# Altium schematic sheet Stepper_driver_group.SchDoc: STM32F446 CNC
size C; Author: AM; CompanyName: Expatria Technologies; DrawnBy: A.Marles; Engineer: AM; Organization: Expatria Technologies; DocumentNumber: 4; SheetNumber: 4; SheetTotal: 14
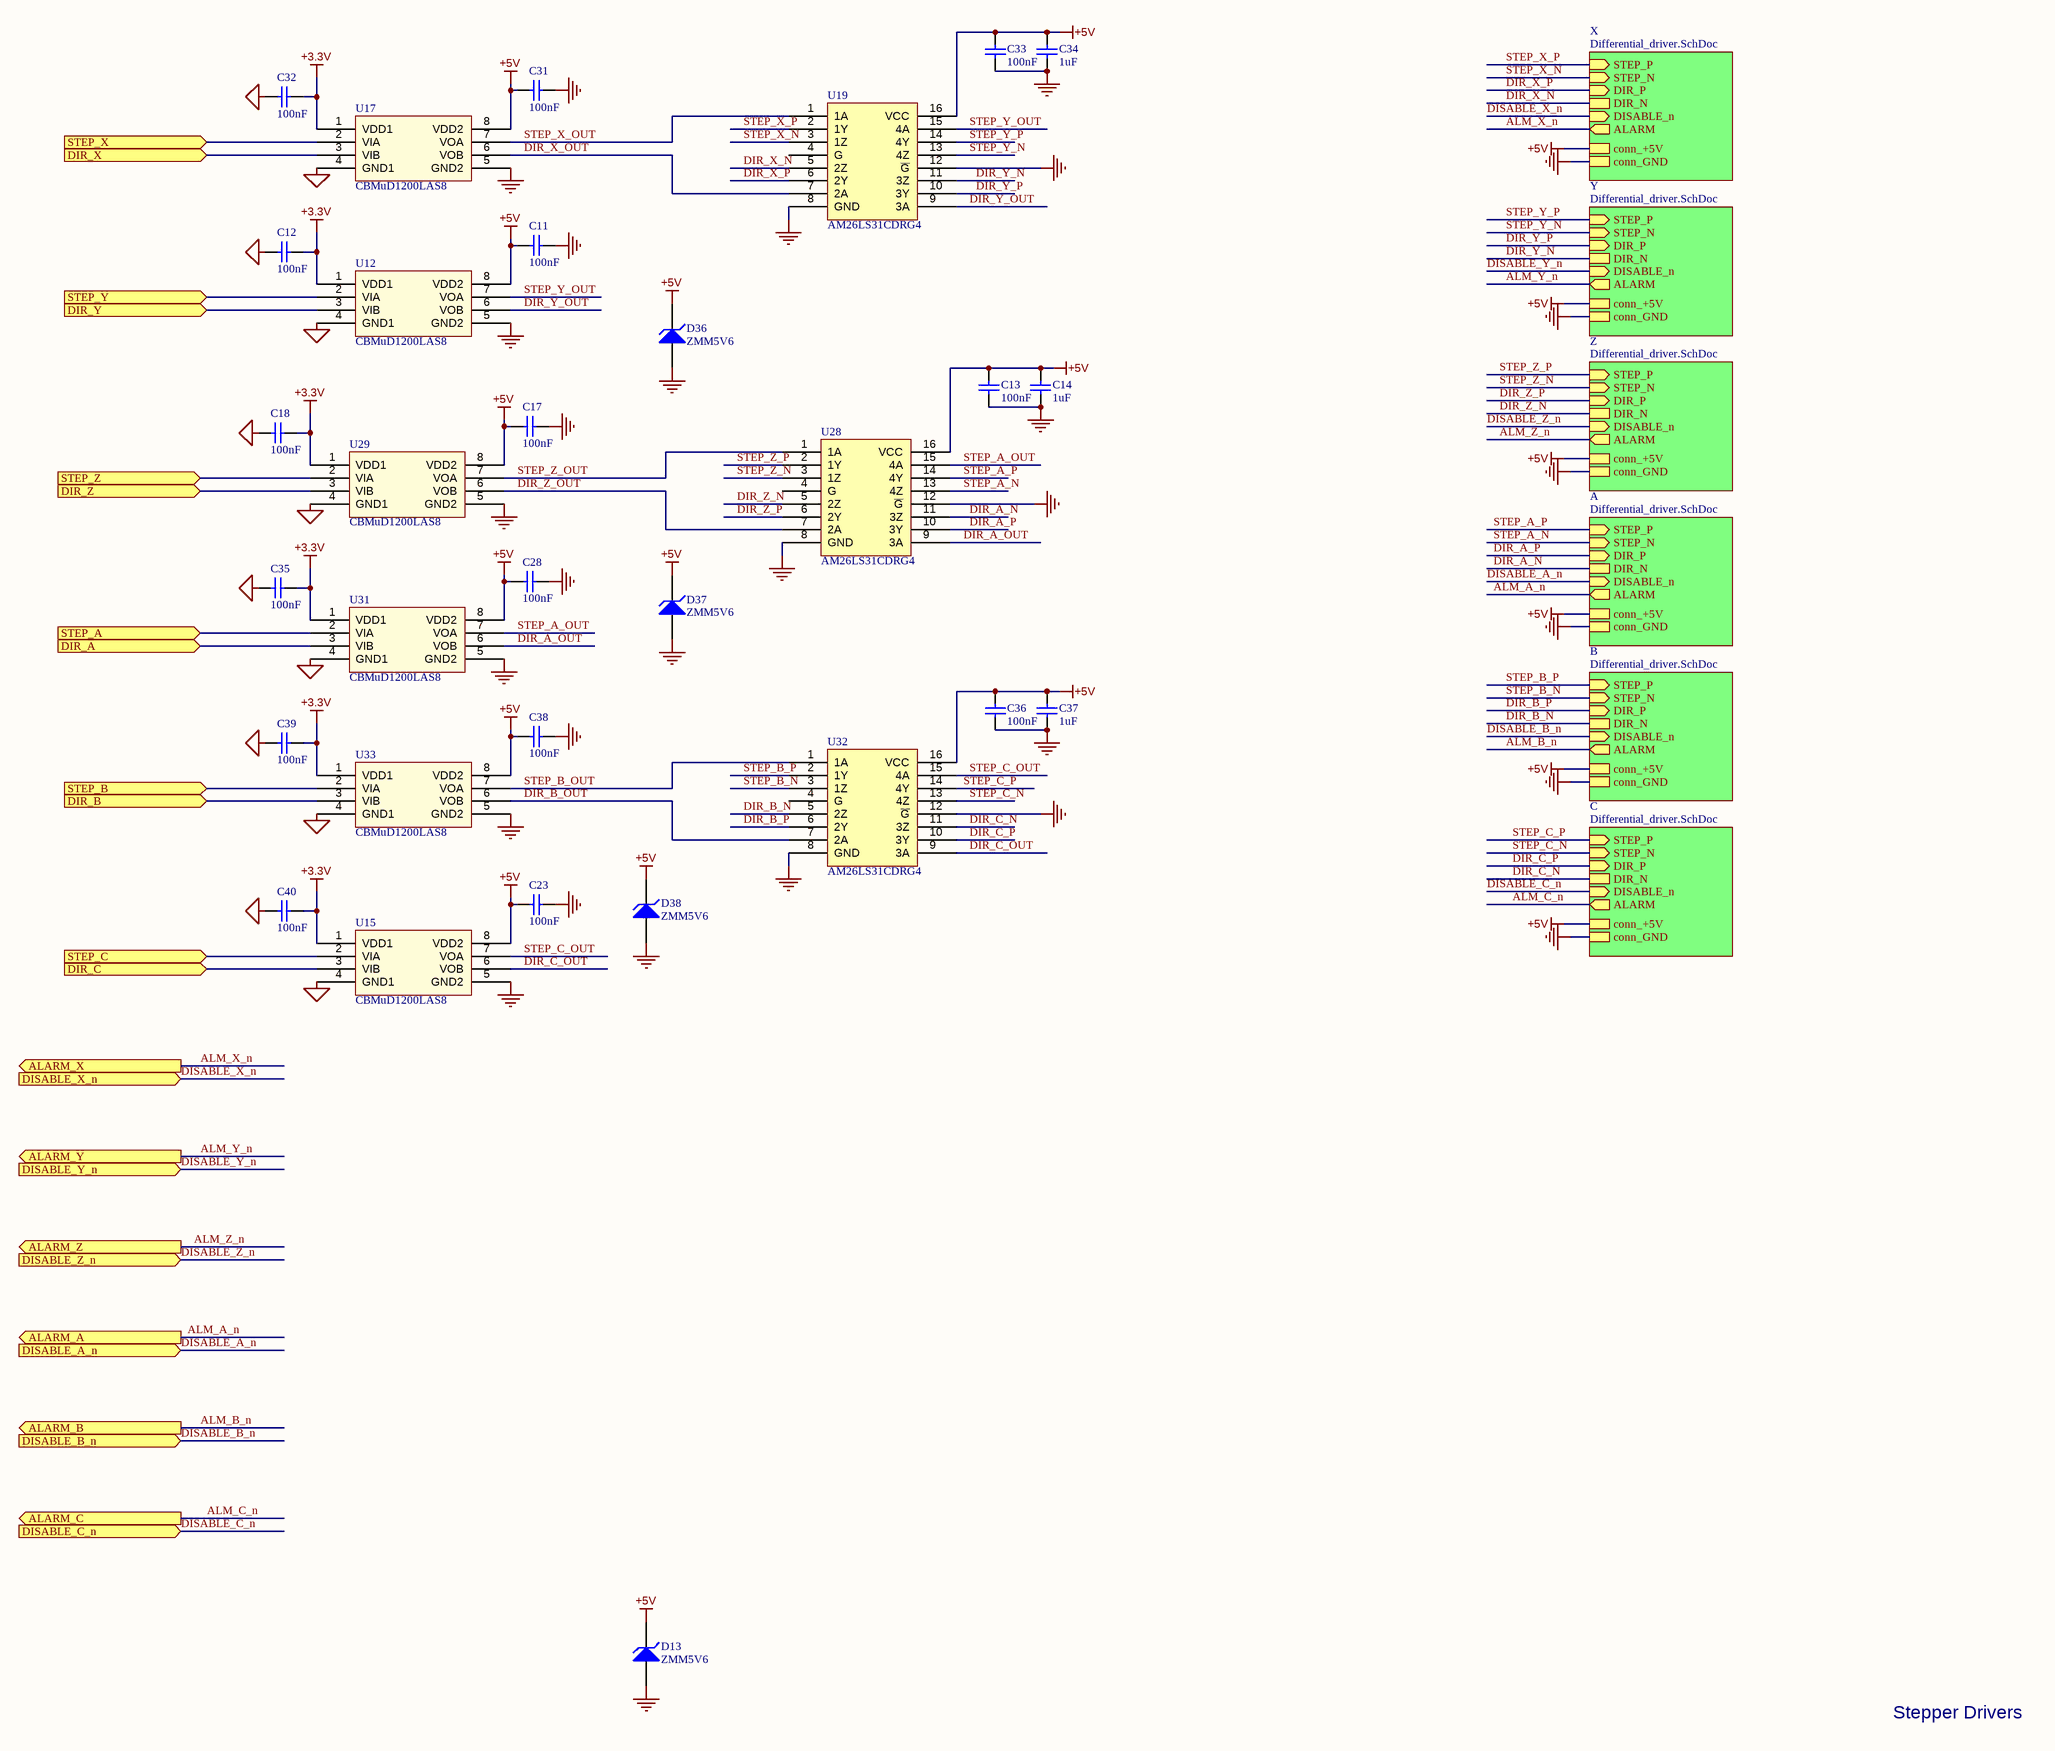
[diagram p0: Stepper_driver_group.SchDoc]

## Parts
C11  100nF  [0402_C]
C12  100nF  [0402_C]
C13  100nF  [0402_C]
C14  1uF  [0603_C]
C17  100nF  [0402_C]
C18  100nF  [0402_C]
C23  100nF  [0402_C]
C28  100nF  [0402_C]
C31  100nF  [0402_C]
C32  100nF  [0402_C]
C33  100nF  [0402_C]
C34  1uF  [0603_C]
C35  100nF  [0402_C]
C36  100nF  [0402_C]
C37  1uF  [0603_C]
C38  100nF  [0402_C]
C39  100nF  [0402_C]
C40  100nF  [0402_C]
D13  ZMM5V6  [LL-34]
D36  ZMM5V6  [LL-34]
D37  ZMM5V6  [LL-34]
D38  ZMM5V6  [LL-34]
U12  CBMuD1200LAS8  [SOIC-8_150mil]
U15  CBMuD1200LAS8  [SOIC-8_150mil]
U17  CBMuD1200LAS8  [SOIC-8_150mil]
U19  AM26LS31CDRG4  [SOIC-16_150mil]
U28  AM26LS31CDRG4  [SOIC-16_150mil]
U29  CBMuD1200LAS8  [SOIC-8_150mil]
U31  CBMuD1200LAS8  [SOIC-8_150mil]
U32  AM26LS31CDRG4  [SOIC-16_150mil]
U33  CBMuD1200LAS8  [SOIC-8_150mil]

## Sub-sheets
A = Differential_driver.SchDoc: DIR_N, conn_GND, DIR_P (in), STEP_P (in), conn_+5V, STEP_N (in), ALARM (out), DISABLE_n (in)
B = Differential_driver.SchDoc: DIR_N, conn_GND, DIR_P (in), STEP_P (in), conn_+5V, STEP_N (in), ALARM (out), DISABLE_n (in)
C = Differential_driver.SchDoc: DIR_N, conn_GND, DIR_P (in), STEP_P (in), conn_+5V, STEP_N (in), DISABLE_n (in), ALARM (out)
X = Differential_driver.SchDoc: DIR_N, conn_GND, DIR_P (in), STEP_P (in), conn_+5V, STEP_N (in), DISABLE_n (in), ALARM (out)
Y = Differential_driver.SchDoc: DIR_N, conn_GND, DIR_P (in), STEP_P (in), conn_+5V, STEP_N (in), DISABLE_n (in), ALARM (out)
Z = Differential_driver.SchDoc: DIR_N, conn_GND, DIR_P (in), STEP_P (in), conn_+5V, STEP_N (in), DISABLE_n (in), ALARM (out)

## Ports
ALARM_A (out), ALARM_B (out), ALARM_C (out), ALARM_X (out), ALARM_Y (out), ALARM_Z (out), DIR_A (in), DIR_B (in), DIR_C (in), DIR_X (in), DIR_Y (in), DIR_Z (in), DISABLE_A_n (in), DISABLE_B_n (in), DISABLE_C_n (in), DISABLE_X_n (in), DISABLE_Y_n (in), DISABLE_Z_n (in), STEP_A (in), STEP_B (in), STEP_C (in), STEP_X (in), STEP_Y (in), STEP_Z (in)

## Nets
+3.3V: C12.1 C18.1 C32.1 C35.1 C39.1 C40.1 U12.1(VDD1) U15.1(VDD1) U17.1(VDD1) U29.1(VDD1) U31.1(VDD1) U33.1(VDD1)
+5V: C11.2 C13.1 C14.1 C17.2 C23.2 C28.2 C31.2 C33.1 C34.1 C36.1 C37.1 C38.2 D13.2(K) D36.2(K) D37.2(K) D38.2(K) U12.8(VDD2) U15.8(VDD2) U17.8(VDD2) U19.16(VCC) U28.16(VCC) U29.8(VDD2) U31.8(VDD2) U32.16(VCC) U33.8(VDD2) ; sheet X/conn_+5V, sheet Y/conn_+5V, sheet Z/conn_+5V, sheet A/conn_+5V, sheet B/conn_+5V, sheet C/conn_+5V
GND: C11.1 C13.2 C14.2 C17.1 C23.1 C28.1 C31.1 C33.2 C34.2 C36.2 C37.2 C38.1 D13.1(A) D36.1(A) D37.1(A) D38.1(A) U12.5(GND2) U15.5(GND2) U17.5(GND2) U19.8(GND) U19.12(~{G}) U28.8(GND) U28.12(~{G}) U29.5(GND2) U31.5(GND2) U32.8(GND) U32.12(~{G}) U33.5(GND2) ; sheet X/conn_GND, sheet Y/conn_GND, sheet Z/conn_GND, sheet A/conn_GND, sheet B/conn_GND, sheet C/conn_GND
MCU_GND: C12.2 C18.2 C32.2 C35.2 C39.2 C40.2 U12.4(GND1) U15.4(GND1) U17.4(GND1) U29.4(GND1) U31.4(GND1) U33.4(GND1)
ALM_A_n: port ALARM_A, sheet A/ALARM
ALM_B_n: port ALARM_B, sheet B/ALARM
ALM_C_n: port ALARM_C, sheet C/ALARM
ALM_X_n: port ALARM_X, sheet X/ALARM
ALM_Y_n: port ALARM_Y, sheet Y/ALARM
ALM_Z_n: port ALARM_Z, sheet Z/ALARM
DIR_A: U31.3(VIB) ; port DIR_A
DIR_A_N: U28.11(3Z) ; sheet A/DIR_N
DIR_A_OUT: U28.9(3A) U31.6(VOB)
DIR_A_P: U28.10(3Y) ; sheet A/DIR_P
DIR_B: U33.3(VIB) ; port DIR_B
DIR_B_N: U32.5(2Z) ; sheet B/DIR_N
DIR_B_OUT: U32.7(2A) U33.6(VOB)
DIR_B_P: U32.6(2Y) ; sheet B/DIR_P
DIR_C: U15.3(VIB) ; port DIR_C
DIR_C_N: U32.11(3Z) ; sheet C/DIR_N
DIR_C_OUT: U15.6(VOB) U32.9(3A)
DIR_C_P: U32.10(3Y) ; sheet C/DIR_P
DIR_X: U17.3(VIB) ; port DIR_X
DIR_X_N: U19.5(2Z) ; sheet X/DIR_N
DIR_X_OUT: U17.6(VOB) U19.7(2A)
DIR_X_P: U19.6(2Y) ; sheet X/DIR_P
DIR_Y: U12.3(VIB) ; port DIR_Y
DIR_Y_N: U19.11(3Z) ; sheet Y/DIR_N
DIR_Y_OUT: U12.6(VOB) U19.9(3A)
DIR_Y_P: U19.10(3Y) ; sheet Y/DIR_P
DIR_Z: U29.3(VIB) ; port DIR_Z
DIR_Z_N: U28.5(2Z) ; sheet Z/DIR_N
DIR_Z_OUT: U28.7(2A) U29.6(VOB)
DIR_Z_P: U28.6(2Y) ; sheet Z/DIR_P
DISABLE_A_n: port DISABLE_A_n, sheet A/DISABLE_n
DISABLE_B_n: port DISABLE_B_n, sheet B/DISABLE_n
DISABLE_C_n: port DISABLE_C_n, sheet C/DISABLE_n
DISABLE_X_n: port DISABLE_X_n, sheet X/DISABLE_n
DISABLE_Y_n: port DISABLE_Y_n, sheet Y/DISABLE_n
DISABLE_Z_n: port DISABLE_Z_n, sheet Z/DISABLE_n
STEP_A: U31.2(VIA) ; port STEP_A
STEP_A_N: U28.13(4Z) ; sheet A/STEP_N
STEP_A_OUT: U28.15(4A) U31.7(VOA)
STEP_A_P: U28.14(4Y) ; sheet A/STEP_P
STEP_B: U33.2(VIA) ; port STEP_B
STEP_B_N: U32.3(1Z) ; sheet B/STEP_N
STEP_B_OUT: U32.1(1A) U33.7(VOA)
STEP_B_P: U32.2(1Y) ; sheet B/STEP_P
STEP_C: U15.2(VIA) ; port STEP_C
STEP_C_N: U32.13(4Z) ; sheet C/STEP_N
STEP_C_OUT: U15.7(VOA) U32.15(4A)
STEP_C_P: U32.14(4Y) ; sheet C/STEP_P
STEP_X: U17.2(VIA) ; port STEP_X
STEP_X_N: U19.3(1Z) ; sheet X/STEP_N
STEP_X_OUT: U17.7(VOA) U19.1(1A)
STEP_X_P: U19.2(1Y) ; sheet X/STEP_P
STEP_Y: U12.2(VIA) ; port STEP_Y
STEP_Y_N: U19.13(4Z) ; sheet Y/STEP_N
STEP_Y_OUT: U12.7(VOA) U19.15(4A)
STEP_Y_P: U19.14(4Y) ; sheet Y/STEP_P
STEP_Z: U29.2(VIA) ; port STEP_Z
STEP_Z_N: U28.3(1Z) ; sheet Z/STEP_N
STEP_Z_OUT: U28.1(1A) U29.7(VOA)
STEP_Z_P: U28.2(1Y) ; sheet Z/STEP_P

Not connected (* = marked no-connect by the designer): U19 4(G); U28 4(G); U32 4(G)

## Notes on the sheet
- Stepper Drivers
- Expatria Technologies
- SHEET
- PROJECT
- REV
- 1136 Glade Court
- Port Coquitlam, BC V3B 1R5
- EMAIL: INFO@EXPATRIA.CA
- SIZE
- ENGR
- C
- MODIFIED
- DOCUMENT
- /
- Copyright Expatria Technologies 2022. This document describes Open Hardware and is licensed under the CERN-OHL-S v2. No warranty is implied or expressed.

## Library data of the parts
C11-C13 C17 C18 C23 C28 C31-C33 C35 C36 C38-C40 = 0402 100nF (104) 10% 16V: Chip capacitors; Manufacturer: Samsung Electro-Mechanics; PartNumber: CL05B104KO5NNNC; Tolerance: 10%; Voltage: 16V; ComponentLink1Description: Supplier link; ComponentLink1URL: http://www.szlcsc.com/product/details_1877.html; Package: 0402; Supplier: LC; SuppliersPartNumber: C1525; Capacitance: 100nF
C14 C34 C37 = 0603 1uF (105) 10% 50V: Chip capacitors; Manufacturer: Samsung Electro-Mechanics; PartNumber: CL10A105KB8NNNC; Tolerance: 10%; Voltage: 50V; ComponentLink1Description: Supplier link; ComponentLink1URL: http://www.szlcsc.com/product/details_16531.html; Package: 0603; Supplier: LC; SuppliersPartNumber: C15849; Capacitance: 1uF
D13 D36-D38 = LL-34 ZMM5V6: 500mW - 0.1uA @ 1V 5.6V LL-34 Zener Diodes ROHS; ComponentLink1Description: 供应商链接; ComponentLink1URL: http://www.szlcsc.com/product/details_8541.html; Package: LL-34; Supplier: LC; SuppliersPartNumber: C8062
U12 U15 U17 U29 U31 U33 = CBMuD1200LAS8: Dual Channel Isolator; Package: SOIC-8_150mil; Supplier: LC; SuppliersPartNumber: C476470; ComponentLink1Description: 供应商链接; ComponentLink1URL: http://www.szlcsc.com/product/details_10199.html
U19 U28 U32 = AM26LS31CDRG4_[C6179]: 4/0 Driver - RS422, RS485 16-SOIC; Manufacturer 1: Texas Instruments; ComponentLink1Description: 供应商链接; ComponentLink1URL: http://www.szlcsc.com/product/details_6645.html; Package: SOIC-16_150mil; Supplier: LC; SuppliersPartNumber: C6179; Manufacturer Part Number 1: AM26LS31CDR